# Altium schematic sheet AnalogSignal.SchDoc
size A4
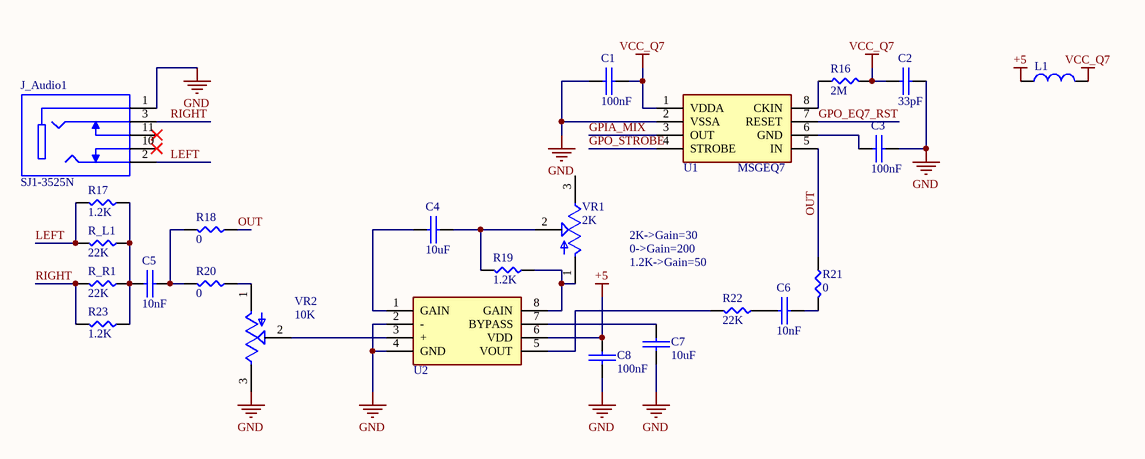
[diagram p0: AnalogSignal.SchDoc]

## Parts
C1  100nF  [0603]
C2  33pF  [0603]
C3  100nF  [0603]
C4  10uF  [0603]
C5  10nF  [0603]
C6  10nF  [0603]
C7  10uF  [0603]
C8  100nF  [0603]
J_Audio1  SJ1-3525N  [CUI_SJ1-3525N]
L1  (no value)  [0603]
R16  2M  [0603]
R17  1.2K  [0603]
R18  0  [0603]
R19  1.2K  [0603]
R20  0  [0603]
R21  0  [0603]
R22  22K  [0603]
R23  1.2K  [0603]
R_L1  22K  [0603]
R_R1  22K  [0603]
U1  MSGEQ7  [MSGEQ7]
U2  LM386  [MSGEQ7]  (value not drawn)
VR1  2K  [TRIM_3362P]
VR2  10K  [TRIM_3362P]

## Nets
+5: C8.2 L1.1 U2.6(VDD)
GND: C1.2 C2.2 C3.1 C7.1 C8.1 J_Audio1.1 U1.2(VSSA) U2.2(-) U2.4(GND) VR2.3(CW)
VCC_Q7: C1.1 C2.1 L1.2 R16.2 U1.1(VDDA)
GPIA_MIX: U1.3(OUT)
GPO_EQ7_RST: U1.7(RESET)
GPO_STROBE: U1.4(STROBE)
LEFT: J_Audio1.2 R17.2 R_L1.2
OUT: R18.1 R21.1 U1.5(IN)
RIGHT: J_Audio1.3 R23.2 R_R1.2
NetC3_2: C3.2 U1.6(GND)
NetC4_1: C4.1 U2.1(GAIN)
NetC4_2: C4.2 R19.2 VR1.2(WIPER)
NetC5_1: C5.1 R17.1 R23.1 R_L1.1 R_R1.1
NetC5_2: C5.2 R18.2 R20.2
NetC6_1: C6.1 R22.1
NetC6_2: C6.2 R21.2
NetC7_2: C7.2 U2.7(BYPASS)
NetR16_1: R16.1 U1.8(CKIN)
NetR19_1: R19.1 U2.8(GAIN) VR1.1(CCW)
NetR20_1: R20.1 VR2.1(CCW)
NetR22_2: R22.2 U2.5(VOUT)
NetU2_3: U2.3(+) VR2.2(WIPER)

Not connected (* = marked no-connect by the designer): J_Audio1 10* 11*; VR1 3(CW)

## Notes on the sheet
- 0->Gain=200
- 2K->Gain=30
- 1.2K->Gain=50

## Library data of the parts
C1-C8 = Cap
  C1 C3 C8: value: 100nF
  C2: value: 33pF
  C4 C7: value: 10uF
  C5 C6: value: 10nF
J_Audio1 = SJ1-3525N: 3.5 mm, Stereo, Right Angle, Through Hole, Audio Jack Connector; MF: CUI Devices; Package: None; Price: None; Availability: Unavailable; MP: SJ1-3525N; CUI_purchase_URL: https://www.cuidevices.com/product/interconnect/connectors/audio-connectors/jacks/sj1-352xn-series?utm_source=snapeda.com&utm_medium=referral&utm_campaign=snapedaBOM; SnapEDA_Link: https://www.snapeda.com/parts/SJ1-3525N/CUI%20Devices/view-part/231506/?ref=snap; Value: *
L1 = Ind
R16-R23 R_L1 R_R1 = Res
  R16: value: 2M
  R17 R19 R23: value: 1.2K
  R18 R20 R21: value: 0
  R22 R_L1 R_R1: value: 22K
U1 = MSGEQ7: Seven Band Graphic Equalizer
U2 = LM386: Low Voltage Audio Power Amplifier
VR1 VR2 = 3362P: PC Pins Through Hole Trimmer Potentiometer Cermet 1 Turn Top Adjustment; MF: Bourns; MP: 3362P-1-103LF; Check_prices: https://www.snapeda.com/parts/3362P-1-103LF/Bourns/view-part/13764/?ref=eda; Digi-Key_Part_Number: 3362P-103LF-ND; Package: 3116 Bourns; SnapEDA_Link: https://www.snapeda.com/parts/3362P-1-103LF/Bourns/view-part/13764/?ref=snap; Purchase-URL: https://pricing.snapeda.com/search/part/3362P-1-103LF/?ref=eda
  VR1: Value: 2K
  VR2: Value: 10K